# Altium schematic sheet RS485.SchDoc
size A
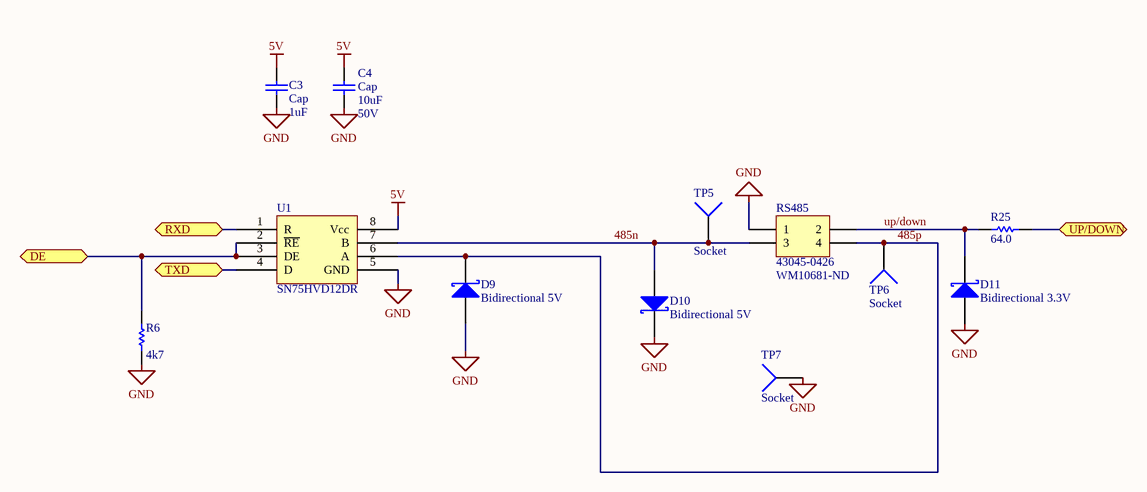
[diagram p0: RS485.SchDoc]

## Parts
C3  Cap  value 1uF  [RESC3116X65N]
C4  Cap  value 10uF  Voltage Rating: 50V  [CAPC3216X180N]
D9  Bidirectional 5V  [THRMC0603X33N]
D10  Bidirectional 5V  [THRMC0603X33N]
D11  Bidirectional 3.3V  [THRMC0603X33N]
R6  value 4k7  [0402]  (hidden comment: Res1)
R25  value 64.0  [0402]  (hidden comment: Res1)
RS485  43045-0426  Vendor Part Number: WM10681-ND  [43045-0426]
TP5  Socket  [5006]
TP6  Socket  [5006]
TP7  Socket  [5006]
U1  SN75HVD12DR  [SOIC127P599X175-8N]

## Ports
DE, RXD, TXD, UP/DOWN

## Nets
5V: C3.2 C4.2 U1.8(Vcc)
GND: C3.1 C4.1 D9.3(A) D10.1(K) D11.3(A) R6.2 RS485.1 TP7.1 U1.5(GND)
485n: D10.3(A) RS485.3 TP5.1 U1.7(B)
485p: D9.1(K) RS485.4 TP6.1 U1.6(A)
DE: R6.1 U1.2(~{RE}) U1.3(DE) ; port DE
RXD: U1.1(R) ; port RXD
TXD: U1.4(D) ; port TXD
up/down: D11.1(K) R25.2 RS485.2
UP/DOWN: R25.1 ; port UP/DOWN  [a separate net that carries the same name]

## Library data of the parts
C3 = Cap: Capacitor; Manufacturer Part Number: CL31B105KCHNNNE; Vendor Part Number: 1276-1838-1-ND
C4 = Cap: Capacitor; Manufacturer Part Number: CL31A106MBHNNNE; Vendor Part Number: 1276-6736-1-ND
D9 D10 = Diode 10TQ040: TVS; Manufacturer Part Number: CPDUC5V0R-HF; Vendor Part Number: 641-1764-1-ND
D11 = Diode 10TQ040: TVS; Manufacturer Part Number: SP1103C-01UTG; Vendor Part Number: F10154CT-ND
R6 = Res1: Resistor; Manufacturer Part Number: RC0402FR-074K7L; Vendor Part Number: 311-4.7KLRCT-ND; Tolerance: 1%
R25 = Res1: Resistor; Manufacturer Part Number: RC0402FR-0760R4L; Vendor Part Number: 311-60.4LRCT-ND; Tolerance: 1%; DNP: *
RS485 = Header 2X2: Header, 2-Pin, Dual row; LatestRevisionDate: 17-Jul-2002; LatestRevisionNote: Re-released for DXP Platform.; Publisher: Altium Limited
TP5-TP7 = Socket: Vendor Part Number: 36-5006-ND; LatestRevisionDate: 17-Jul-2002; LatestRevisionNote: Re-released for DXP Platform.; Publisher: Altium Limited; Manufacturer Part Number: 5006
U1 = SN75HVD12DR: Manufacturer Part Number: THVD1450DR; Vendor Part Number: 296-50395-1-ND; Vendor: Digikey